# Altium schematic sheet Power.SchDoc
size A4; SheetNumber: 1; SheetTotal: 2; SPICEModelCacheCCCFIGUR: <root> / <DocumentId>CCCFIGUR</DocumentId> / <CacheFrame Number="0"> / <Model Name="led0" Kind="MDL"> / <Text>*Typ INFRARED GaAs LED: Vf=1.2V Vr=5V If=40mA trr=3uS / *LED Pinout: 1=A, 2=K / .MODEL LED0 D (IS=93.5P RS=84M N=2.63 BV=5 IBV=10U / + CJO=2.97P VJ=.75 M=.333 TT=4.32U)</Text> / </Model> / </CacheFrame> / </root>
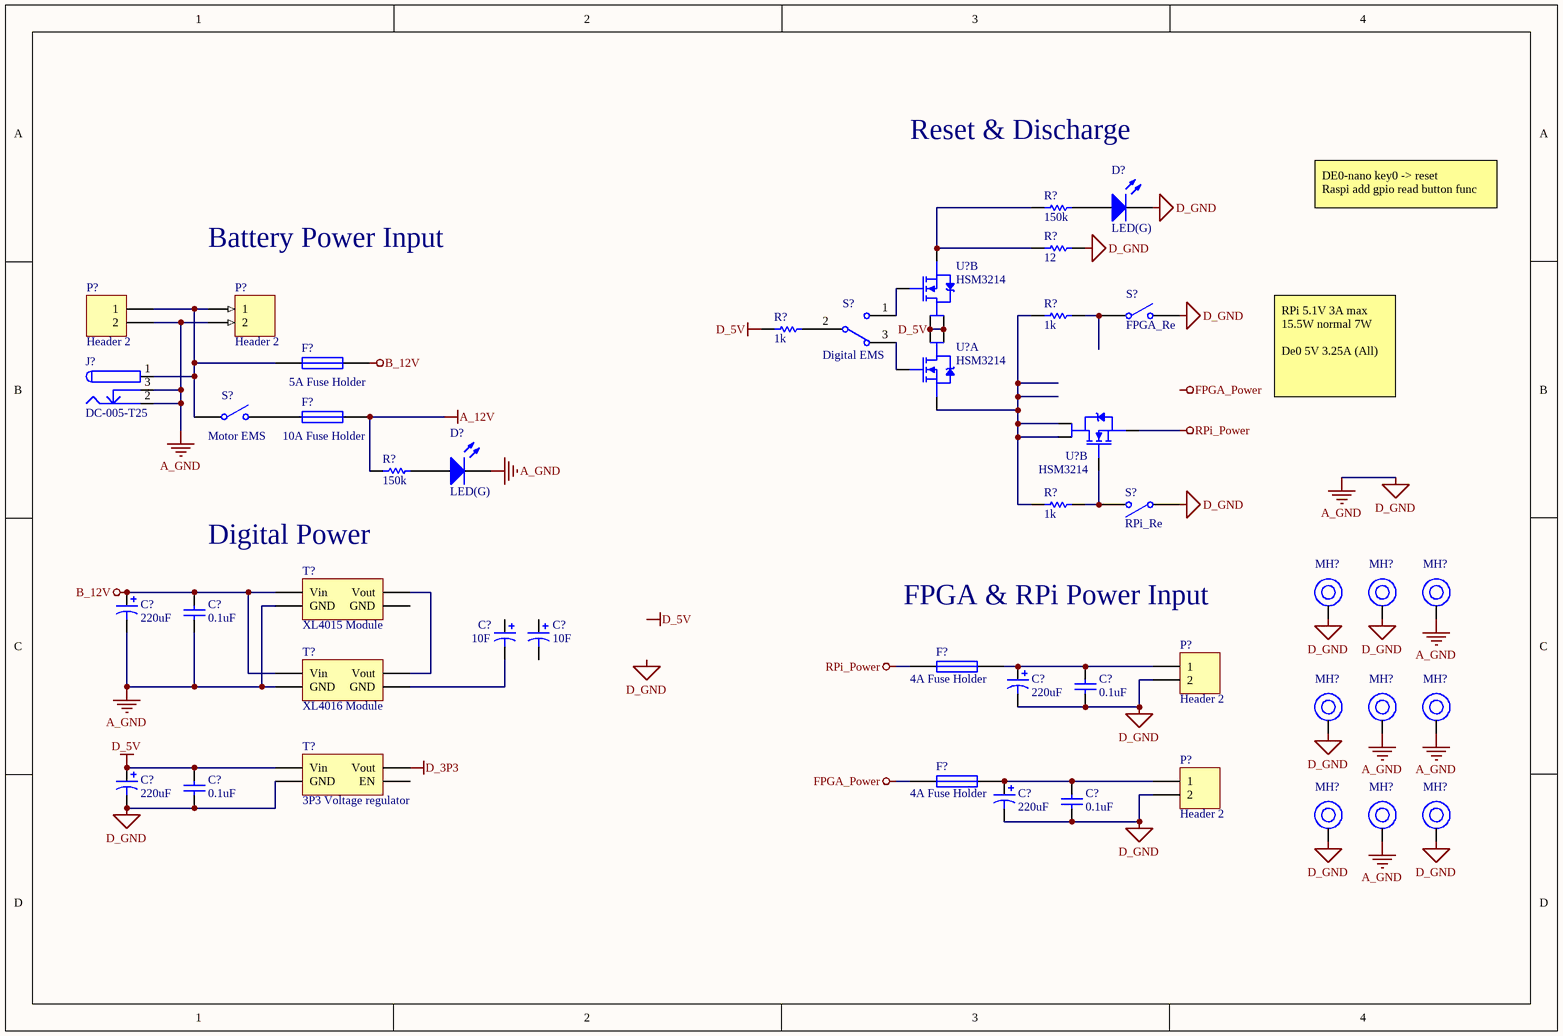
[diagram p0: Power.SchDoc]

## Parts
(Parts that share a designator on the sheet are numbered #1, #2 ... from top to bottom, then left to right.)
C?#1  220uF  [VZT221M1ETR-0607]
C?#2  0.1uF  [1210B104K500NT]
C?#3  10F  [SUPPYCAP-DIP_L33.0_W16.5]
C?#4  10F  [SUPPYCAP-DIP_L33.0_W16.5]
C?#5  220uF  [VZT221M1ETR-0607]
C?#6  0.1uF  [1210B104K500NT]
C?#7  220uF  [VZT221M1ETR-0607]
C?#8  0.1uF  [1210B104K500NT]
C?#9  220uF  [VZT221M1ETR-0607]
C?#10  0.1uF  [1210B104K500NT]
D?#1  LED(G)  [BL-HG036D-AV-TRB]
D?#2  LED(G)  [BL-HG036D-AV-TRB]
F?#1  5A Fuse Holder  [SMD Fuses Holder]
F?#2  10A Fuse Holder  [SMD Fuses Holder]
F?#3  4A Fuse Holder  [SMD Fuses Holder]
F?#4  4A Fuse Holder  [SMD Fuses Holder]
J?  DC-005-T25  [DC-005-T25]
MH?#1  M3 Hole  [M3 Hole]  (value not drawn)
MH?#2  M3 Hole  [M3 Hole]  (value not drawn)
MH?#3  M3 Hole  [M3 Hole]  (value not drawn)
MH?#4  M3 Hole  [M3 Hole]  (value not drawn)
MH?#5  M3 Hole  [M3 Hole]  (value not drawn)
MH?#6  M3 Hole  [M3 Hole]  (value not drawn)
MH?#7  M3 Hole  [M3 Hole]  (value not drawn)
MH?#8  M3 Hole  [M3 Hole]  (value not drawn)
MH?#9  M3 Hole  [M3 Hole]  (value not drawn)
P?#1  Header 2  [XT60PW-M]
P?#2  Header 2  [B2B-XH-A(LF)(SN)]
P?#3  Header 2  [B2B-XH-A(LF)(SN)]
P?#4  Header 2  [B2B-XH-A(LF)(SN)]
R?#1  150k  [RS-03K1503FT]
R?#2  12  [MOF3WS-12Ω±5%T]
R?#3  1k  [RS-03K1503FT]
R?#4  1k  [RS-03K1503FT]
R?#5  150k  [RS-03K1503FT]
R?#6  1k  [RS-03K1503FT]
S?#1  FPGA_Re  [SKHMQLE010]
S?#2  Digital EMS  [ST-0-102-C03-N003-RS]
S?#3  Motor EMS  [JNQ032]
S?#4  RPi_Re  [SKHMQKE010]
T?#1  XL4015 Module  [XL4015 Voltage Regulator Module]
T?#2  XL4016 Module  [XH-M401 Voltage Regulator Module]
T?#3  3P3 Voltage regulator  [Small Voltage regulator module]
U?#1  HSM3214  [HSM3214]  (part B of 2)
U?#2  HSM3214  [HSM3214]  (part A of 2)
U?#3  HSM3214  [HSM3214]  (part B of 2)

## Nets
A_12V: F?#2.2 R?#5.2
A_GND: C?#1.2 C?#2.1 C?#5.2 C?#6.1 C?#7.2 C?#8.1 C?#9.2 C?#10.1 D?#1.2(K) D?#2.2(K) J?.2 J?.3 MH?#1.1 MH?#2.1 MH?#3.1 MH?#4.1 MH?#5.1 MH?#6.1 MH?#7.1 MH?#8.1 MH?#9.1 P?#1.2 P?#2.2 P?#3.2 P?#4.2 R?#2.1 S?#1.2(NO) S?#4.1(COMMON) T?#1.2(GND) T?#2.2(GND) T?#3.2(GND)  [also labelled D_GND]
B_12V: C?#1.1 C?#2.2 F?#1.2 T?#1.1(Vin) T?#2.1(Vin)
D_3P3: T?#3.3(Vout)
D_5V: C?#7.1 C?#8.2 R?#4.2 T?#3.1(Vin) U?#1.5(D1) U?#1.6(D1) U?#2.7(D1) U?#2.8(D1)
FPGA_Power: F?#4.1
RPi_Power: F?#3.1 U?#3.3(S1)
NetC?#3_2: C?#3.2 T?#2.4(GND)
NetC?#5_1: C?#5.1 C?#6.2 F?#3.2 P?#3.1
NetC?#9_1: C?#9.1 C?#10.2 F?#4.2 P?#4.1
NetD?#1_1: D?#1.1(A) R?#1.1
NetD?#2_1: D?#2.1(A) R?#5.1
NetF?#1_1: F?#1.1 J?.1 P?#1.1 P?#2.1 S?#3.1(COMMON)
NetF?#2_1: F?#2.1 S?#3.2(NO)
NetR?#1_2: R?#1.2 R?#2.2 U?#1.3(S1)
NetR?#3_1: R?#3.1 S?#1.1(COMMON)
NetR?#3_2: R?#3.2 R?#6.2 U?#2.1(S1) U?#3.5(D1) U?#3.6(D1)
NetR?#4_1: R?#4.1 S?#2.2
NetR?#6_1: R?#6.1 S?#4.2(NO) U?#3.4(G1)
NetS?#2_1: S?#2.1 U?#1.4(G1)
NetS?#2_3: S?#2.3 U?#2.2(G1)
NetT?#1_3: T?#1.3(Vout) T?#2.3(Vout)

Not connected (* = marked no-connect by the designer): C?#3 1; C?#4 1 2; T?#1 4(GND); T?#3 4(EN)

## Notes on the sheet
- Reset & Discharge
- Battery Power Input
- DE0-nano key0 -> reset
  Raspi add gpio read button func
- RPi 5.1V 3A max 15.5W normal 7W
  De0 5V 3.25A (All)
- Digital Power
- FPGA & RPi Power Input
- Labels drawn without touching a wire or pin: D_5V, D_GND, FPGA_Power

## Library data of the parts
C?#1 C?#5 C?#7 C?#9 = Cap Pol1: -45℃~+105℃ 2000hrs@105℃ 220uF 7.7mm 25V 6.3mm ±20% SMD,6.3x7.7mm  Aluminum Electrolytic Capacitors - SMD ROHS; Published: 8-Jun-2000; LatestRevisionDate: 17-Jul-2002; LatestRevisionNote: Re-released for DXP Platform.; PackageReference: RB7.6-15; Publisher: Altium Limited; PackageDescription: Polarized Capacitor (Radial); 2 Leads
C?#2 C?#6 C?#8 C?#10 = Cap Semi: 50V 100nF X7R ±10% 1210  Multilayer Ceramic Capacitors MLCC - SMD/SMT ROHS; Published: 8-Jun-2000; LatestRevisionDate: 29-May-2009; LatestRevisionNote: IPC-7351 Footprint Added.; PackageReference: C1206; Publisher: Altium Limited; PackageDescription: Chip Capacitor
C?#3 C?#4 = Cap Pol1: CAPACITOR 10F -10% +30% 5.5V T/H; Published: 8-Jun-2000; LatestRevisionDate: 17-Jul-2002; LatestRevisionNote: Re-released for DXP Platform.; PackageReference: RB7.6-15; Publisher: Altium Limited; PackageDescription: Polarized Capacitor (Radial); 2 Leads
D?#1 D?#2 = LED0: Green-yellow 0603 Light Emitting Diodes (LED) RoHS; Published: 8-Jun-2000; LatestRevisionDate: 08-Jul-2005; LatestRevisionNote: Mech Layer 1 removed.; PackageReference: LED-0; Publisher: Altium Limited; PackageDescription: LED; 2 Leads
F?#1 = Fuse 1: 01550900M (Fuse Holder) / SMD,9.73x5.03mm Fuse Holders ROHS / ----- / 0451005.MRL (Fuse) / FastBlow 50A SMD Fuse 5A 5.566 12.5mΩ SMD  Fuses ROHS; Published: 8-Jun-2000; LatestRevisionDate: 17-Jul-2002; LatestRevisionNote: Re-released for DXP Platform.; PackageReference: PIN-W2/E2.8; Publisher: Altium Limited; PackageDescription: Thru-Hole; 2 Leads
F?#2 = Fuse 1: 01550900M (Fuse Holder) / SMD,9.73x5.03mm Fuse Holders ROHS / ----- / 0451010.MRL (Fuse) / FastBlow 50A SMD Fuse 10A 26.46 5.6mΩ SMD  Fuses ROHS; Published: 8-Jun-2000; LatestRevisionDate: 17-Jul-2002; LatestRevisionNote: Re-released for DXP Platform.; PackageReference: PIN-W2/E2.8; Publisher: Altium Limited; PackageDescription: Thru-Hole; 2 Leads
F?#3 F?#4 = Fuse 1: 01550900M (Fuse Holder) / SMD,9.73x5.03mm Fuse Holders ROHS / ----- / 0451004.MRL (Fuse) / FastBlow 50A SMD Fuse 4A 3.152 16mΩ SMD  Fuses ROHS; Published: 8-Jun-2000; LatestRevisionDate: 17-Jul-2002; LatestRevisionNote: Re-released for DXP Platform.; PackageReference: PIN-W2/E2.8; Publisher: Altium Limited; PackageDescription: Thru-Hole; 2 Leads
J? = PWR2.5: Shrouded DC Power Receptacle -10℃~+60℃ 2.5mm 6.3mm 3A 30V Plugin AC/DC Power Connectors ROHS; Published: 17-Dec-2003; DatasheetDocument: 09-May-2002; Publisher: Altium Limited; ComponentLink1Description: Manufacturer Link; ComponentLink1URL: http://domino.kycon.com/internet/Products.html
MH?#1-MH?#9 = M3_Hole
P?#1 = Header 2: XT60PW-F 500V 45A Through Hole Power Connectors ROHS; LatestRevisionDate: 17-Jul-2002; LatestRevisionNote: Re-released for DXP Platform.; Publisher: Altium Limited
P?#2-P?#4 = Header 2: 1x2P XH 1 2.5mm 2 Brass Plugin,P=2.5mm  Wire To Board / Wire To Wire Connector ROHS; LatestRevisionDate: 17-Jul-2002; LatestRevisionNote: Re-released for DXP Platform.; Publisher: Altium Limited
R?#1 R?#3-R?#6 = Res1: 100mW 50V ±1% ±100ppm/℃ -55℃~+155℃ 150kΩ 0603  Chip Resistor - Surface Mount ROHS; Published: 8-Jun-2000; LatestRevisionDate: 17-Jul-2002; LatestRevisionNote: Re-released for DXP Platform.; PackageReference: AXIAL-0.3; Publisher: Altium Limited; PackageDescription: Axial Device, Thru-Hole; 2 Leads; 0.3 in Pin Spacing
R?#2 = Res1: Metal Oxide Resistors 12Ω 3W ±700ppm/℃ ±5% Axial Leaded  Through Hole Resistors ROHS; Published: 8-Jun-2000; LatestRevisionDate: 17-Jul-2002; LatestRevisionNote: Re-released for DXP Platform.; PackageReference: AXIAL-0.3; Publisher: Altium Limited; PackageDescription: Axial Device, Thru-Hole; 2 Leads; 0.3 in Pin Spacing
S?#1 S?#4 = SW-SPST: 6.2mm 3.1mm Round Button 50mA Brick nogging 6.5mm SPST 12V SMD  Tactile Switches ROHS; Published: 24-Mar-1999; LatestRevisionDate: 17-Jul-2002; LatestRevisionNote: Re-released for DXP Platform.; PackageReference: SPST-2; Publisher: Altium Limited; PackageDescription: Switch; 2 Leads
S?#2 = SW-SPDT: Cylindrical button handle 125V -25℃~85℃ SPDT PCPin 40000 3A Plugin  Toggle Switches ROHS; Published: 24-Mar-1999; LatestRevisionDate: 17-Dec-2003; LatestRevisionNote: Schematic revised, PCB Footprint replaced.; DatasheetVersion: 05-Dec-2000; PackageReference: TL36WW15050; Publisher: Altium Limited; PackageDescription: Switch; 4 Leads; ComponentLink1Description: Manufacturer Link; ComponentLink1URL: http://www.apem.com
S?#3 = SW-SPST: JNQ032 (Header) / 30A Short Connection Quick connect terminal Plugin  Cold-pressed?Terminals ROHS / ----- / RT-S02-113-R42BR (Switch) / Through Hole Rocker Switches ROHS; Published: 24-Mar-1999; LatestRevisionDate: 17-Jul-2002; LatestRevisionNote: Re-released for DXP Platform.; PackageReference: SPST-2; Publisher: Altium Limited; PackageDescription: Switch; 2 Leads
T?#1 = Non-isolated Voltage regulator: XL4015E1 (Module) / Step-down type TO-263-5  DC-DC Converters ROHS / ----- / A2541HWV-2x2P (Header) / 2.54mm 2.54mm Gold Brass Straight 2x2P 4 2 Plugin,P=2.54mm  Female Headers ROHS
T?#2 = Non-isolated Voltage regulator: NO Step-down type 1 Step-down 1.25V~36V 8V~40V 8A 180kHz TO-220-5  DC-DC Converters ROHS
T?#3 = Non-isolated Voltage regulator: 3A Non-isolated Voltage Regulator; ComponentLink1Description: buy_link; ComponentLink1URL: https://www.ruten.com.tw/item/show?21817939184609
U?#1-U?#3 = HSM3214: 30V 10A 12mΩ@10V,8A 1.5W 2.5V@250μA 2 N-Channel SOP-8  MOSFETs ROHS